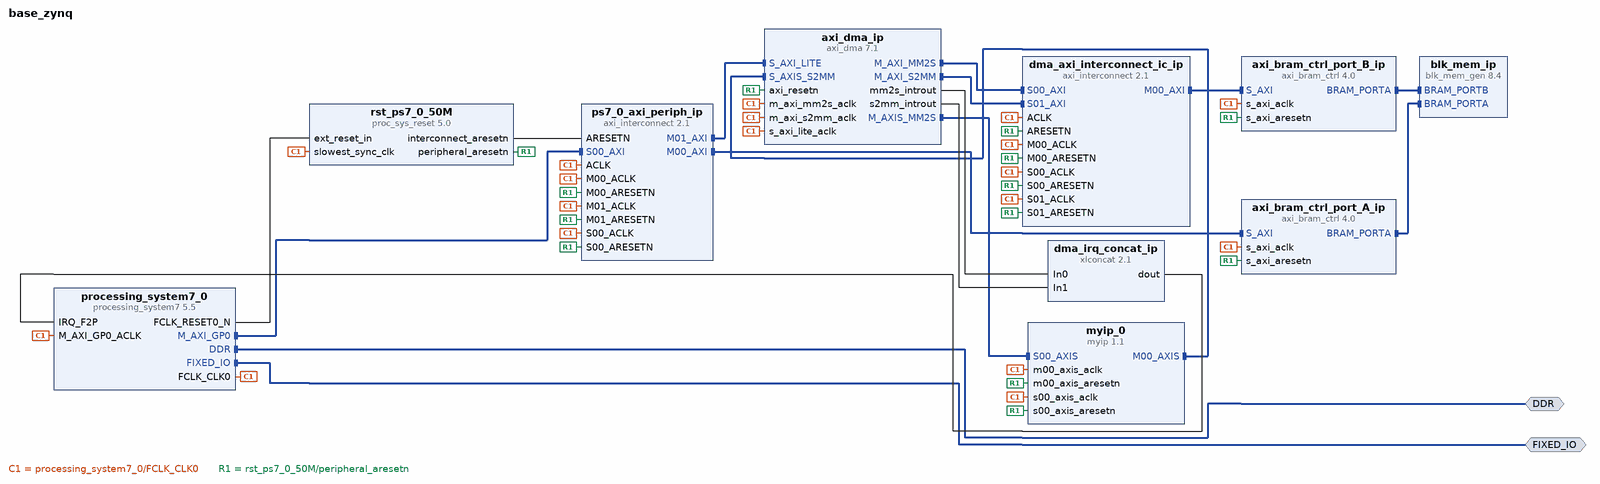
[diagram p0: block diagram of the top level]
# Vivado block design base_zynq, xc7z045ffg900-2, Vivado 2017.4
create_bd_design base_zynq

create_bd_intf_port -mode Master -vlnv xilinx.com:interface:ddrx_rtl:1.0 DDR
create_bd_intf_port -mode Master -vlnv xilinx.com:display_processing_system7:fixedio_rtl:1.0 FIXED_IO

create_bd_cell -type ip -vlnv xilinx.com:ip:xlconcat:2.1 dma_irq_concat_ip
create_bd_cell -type ip -vlnv xilinx.com:ip:axi_bram_ctrl:4.0 axi_bram_ctrl_port_A_ip
set_property -dict {CONFIG.SINGLE_PORT_BRAM 1 CONFIG.C_SELECT_XPM 0} [get_bd_cells axi_bram_ctrl_port_A_ip]
create_bd_cell -type ip -vlnv xilinx.com:ip:axi_bram_ctrl:4.0 axi_bram_ctrl_port_B_ip
set_property -dict {CONFIG.SINGLE_PORT_BRAM 1 CONFIG.C_SELECT_XPM 0} [get_bd_cells axi_bram_ctrl_port_B_ip]
create_bd_cell -type ip -vlnv xilinx.com:ip:axi_dma:7.1 axi_dma_ip
set_property -dict [list \
  CONFIG.c_include_sg 0 \
  CONFIG.c_sg_length_width 23 \
  CONFIG.c_mm2s_burst_size 256 \
  CONFIG.c_s2mm_burst_size 256 \
] [get_bd_cells axi_dma_ip]
create_bd_cell -type ip -vlnv xilinx.com:ip:axi_interconnect:2.1 dma_axi_interconnect_ic_ip
set_property -dict {CONFIG.NUM_SI 2 CONFIG.NUM_MI 1 CONFIG.SYNCHRONIZATION_STAGES 2} [get_bd_cells dma_axi_interconnect_ic_ip]
create_bd_cell -type ip -vlnv xilinx.com:ip:blk_mem_gen:8.4 blk_mem_ip
set_property -dict [list \
  CONFIG.Memory_Type True_Dual_Port_RAM \
  CONFIG.Enable_B Use_ENB_Pin \
  CONFIG.Use_RSTB_Pin true \
  CONFIG.Port_B_Clock 100 \
  CONFIG.Port_B_Write_Rate 50 \
  CONFIG.Port_B_Enable_Rate 100 \
  CONFIG.EN_SAFETY_CKT false \
] [get_bd_cells blk_mem_ip]
create_bd_cell -type ip -vlnv xilinx.com:ip:processing_system7:5.5 processing_system7_0
set_property -dict [list \
  CONFIG.PCW_UIPARAM_DDR_FREQ_MHZ 533.333313 \
  CONFIG.PCW_CPU_CPU_6X4X_MAX_RANGE 800 \
  CONFIG.PCW_APU_PERIPHERAL_FREQMHZ 667.000000 \
  CONFIG.PCW_SDIO_PERIPHERAL_FREQMHZ 50 \
  CONFIG.PCW_UART_PERIPHERAL_FREQMHZ 50 \
  CONFIG.PCW_I2C_PERIPHERAL_FREQMHZ 111.111115 \
  CONFIG.PCW_FPGA0_PERIPHERAL_FREQMHZ 50 \
  CONFIG.PCW_FPGA1_PERIPHERAL_FREQMHZ 50 \
  CONFIG.PCW_USE_FABRIC_INTERRUPT 1 \
  CONFIG.PCW_IRQ_F2P_INTR 1 \
  CONFIG.PCW_GP0_EN_MODIFIABLE_TXN 0 \
  CONFIG.PCW_GP1_EN_MODIFIABLE_TXN 0 \
  CONFIG.PCW_PERIPHERAL_BOARD_PRESET part0 \
  CONFIG.PCW_PRESET_BANK0_VOLTAGE {LVCMOS 1.8V} \
  CONFIG.PCW_PRESET_BANK1_VOLTAGE {LVCMOS 1.8V} \
  CONFIG.PCW_UIPARAM_DDR_PARTNO Custom \
  CONFIG.PCW_QSPI_PERIPHERAL_ENABLE 1 \
  CONFIG.PCW_QSPI_QSPI_IO {MIO 1 .. 6} \
  CONFIG.PCW_QSPI_GRP_SINGLE_SS_ENABLE 0 \
  CONFIG.PCW_DUAL_PARALLEL_QSPI_DATA_MODE x8 \
  CONFIG.PCW_QSPI_GRP_IO1_ENABLE 1 \
  CONFIG.PCW_QSPI_GRP_IO1_IO {MIO 0 9 .. 13} \
  CONFIG.PCW_QSPI_GRP_FBCLK_ENABLE 1 \
  CONFIG.PCW_QSPI_GRP_FBCLK_IO {MIO 8} \
  CONFIG.PCW_QSPI_INTERNAL_HIGHADDRESS 0xFDFFFFFF \
  CONFIG.PCW_ENET0_PERIPHERAL_ENABLE 1 \
  CONFIG.PCW_ENET0_ENET0_IO {MIO 16 .. 27} \
  CONFIG.PCW_ENET0_GRP_MDIO_ENABLE 1 \
  CONFIG.PCW_ENET0_GRP_MDIO_IO {MIO 52 .. 53} \
  CONFIG.PCW_ENET_RESET_ENABLE 1 \
  CONFIG.PCW_ENET_RESET_SELECT {Share reset pin} \
  CONFIG.PCW_ENET0_RESET_ENABLE 1 \
  CONFIG.PCW_ENET0_RESET_IO {MIO 47} \
  CONFIG.PCW_SD0_PERIPHERAL_ENABLE 1 \
  CONFIG.PCW_SD0_SD0_IO {MIO 40 .. 45} \
  CONFIG.PCW_SD0_GRP_CD_ENABLE 1 \
  CONFIG.PCW_SD0_GRP_CD_IO {MIO 14} \
  CONFIG.PCW_SD0_GRP_WP_ENABLE 1 \
  CONFIG.PCW_SD0_GRP_WP_IO {MIO 15} \
  CONFIG.PCW_UART1_PERIPHERAL_ENABLE 1 \
  CONFIG.PCW_UART1_UART1_IO {MIO 48 .. 49} \
  CONFIG.PCW_TTC0_PERIPHERAL_ENABLE 1 \
  CONFIG.PCW_TTC0_TTC0_IO EMIO \
  CONFIG.PCW_USB0_PERIPHERAL_ENABLE 1 \
  CONFIG.PCW_USB0_USB0_IO {MIO 28 .. 39} \
  CONFIG.PCW_USB_RESET_ENABLE 1 \
  CONFIG.PCW_USB_RESET_SELECT {Share reset pin} \
  CONFIG.PCW_USB0_RESET_ENABLE 1 \
  CONFIG.PCW_USB0_RESET_IO {MIO 7} \
  CONFIG.PCW_I2C0_PERIPHERAL_ENABLE 1 \
  CONFIG.PCW_I2C0_I2C0_IO {MIO 50 .. 51} \
  CONFIG.PCW_I2C0_GRP_INT_ENABLE 0 \
  CONFIG.PCW_I2C0_RESET_ENABLE 1 \
  CONFIG.PCW_I2C0_RESET_IO {MIO 46} \
  CONFIG.PCW_I2C_RESET_ENABLE 1 \
  CONFIG.PCW_I2C_RESET_SELECT {Share reset pin} \
  CONFIG.PCW_GPIO_MIO_GPIO_ENABLE 1 \
  CONFIG.PCW_GPIO_MIO_GPIO_IO MIO \
  CONFIG.PCW_ENET0_PERIPHERAL_FREQMHZ {100 Mbps} \
  CONFIG.preset ZC706 \
] [get_bd_cells processing_system7_0]
# 519 more settings of processing_system7_0 are not shown: defaults, MIO pin electricals, DDR timing, and values the tool derives
create_bd_cell -type ip -vlnv xilinx.com:ip:axi_interconnect:2.1 ps7_0_axi_periph_ip
set_property -dict {CONFIG.NUM_MI 2 CONFIG.SYNCHRONIZATION_STAGES 2} [get_bd_cells ps7_0_axi_periph_ip]
create_bd_cell -type ip -vlnv xilinx.com:ip:proc_sys_reset:5.0 rst_ps7_0_50M
create_bd_cell -type ip -vlnv xilinx.com:user:myip:1.1 myip_0

# ---- connections ----

connect_bd_intf_net -intf_net axi_bram_ctrl_0_BRAM_PORTA [get_bd_intf_pins axi_bram_ctrl_port_A_ip/BRAM_PORTA] [get_bd_intf_pins blk_mem_ip/BRAM_PORTA]
connect_bd_intf_net [get_bd_intf_pins processing_system7_0/M_AXI_GP0] [get_bd_intf_pins ps7_0_axi_periph_ip/S00_AXI]
connect_bd_intf_net [get_bd_intf_pins ps7_0_axi_periph_ip/M00_AXI] [get_bd_intf_pins axi_bram_ctrl_port_A_ip/S_AXI]
connect_bd_intf_net [get_bd_intf_pins axi_bram_ctrl_port_B_ip/BRAM_PORTA] [get_bd_intf_pins blk_mem_ip/BRAM_PORTB]
connect_bd_intf_net [get_bd_intf_pins axi_dma_ip/S_AXI_LITE] [get_bd_intf_pins ps7_0_axi_periph_ip/M01_AXI]
connect_bd_intf_net [get_bd_intf_pins axi_dma_ip/M_AXI_MM2S] [get_bd_intf_pins dma_axi_interconnect_ic_ip/S00_AXI]
connect_bd_intf_net [get_bd_intf_pins axi_dma_ip/M_AXI_S2MM] [get_bd_intf_pins dma_axi_interconnect_ic_ip/S01_AXI]
connect_bd_intf_net [get_bd_intf_pins dma_axi_interconnect_ic_ip/M00_AXI] [get_bd_intf_pins axi_bram_ctrl_port_B_ip/S_AXI]
connect_bd_intf_net [get_bd_intf_pins myip_0/M00_AXIS] [get_bd_intf_pins axi_dma_ip/S_AXIS_S2MM]
connect_bd_intf_net [get_bd_intf_pins axi_dma_ip/M_AXIS_MM2S] [get_bd_intf_pins myip_0/S00_AXIS]
connect_bd_intf_net [get_bd_intf_ports DDR] [get_bd_intf_pins processing_system7_0/DDR]
connect_bd_intf_net [get_bd_intf_ports FIXED_IO] [get_bd_intf_pins processing_system7_0/FIXED_IO]
connect_bd_net [get_bd_pins processing_system7_0/FCLK_CLK0] \
  [get_bd_pins axi_bram_ctrl_port_A_ip/s_axi_aclk] [get_bd_pins axi_bram_ctrl_port_B_ip/s_axi_aclk] \
  [get_bd_pins axi_dma_ip/s_axi_lite_aclk] [get_bd_pins axi_dma_ip/m_axi_mm2s_aclk] [get_bd_pins axi_dma_ip/m_axi_s2mm_aclk] \
  [get_bd_pins processing_system7_0/M_AXI_GP0_ACLK] [get_bd_pins rst_ps7_0_50M/slowest_sync_clk] \
  [get_bd_pins dma_axi_interconnect_ic_ip/ACLK] [get_bd_pins dma_axi_interconnect_ic_ip/S00_ACLK] \
  [get_bd_pins dma_axi_interconnect_ic_ip/M00_ACLK] [get_bd_pins dma_axi_interconnect_ic_ip/S01_ACLK] \
  [get_bd_pins ps7_0_axi_periph_ip/ACLK] [get_bd_pins ps7_0_axi_periph_ip/S00_ACLK] \
  [get_bd_pins ps7_0_axi_periph_ip/M00_ACLK] [get_bd_pins ps7_0_axi_periph_ip/M01_ACLK] [get_bd_pins myip_0/s00_axis_aclk] \
  [get_bd_pins myip_0/m00_axis_aclk]
connect_bd_net [get_bd_pins processing_system7_0/FCLK_RESET0_N] [get_bd_pins rst_ps7_0_50M/ext_reset_in]
connect_bd_net [get_bd_pins rst_ps7_0_50M/peripheral_aresetn] \
  [get_bd_pins axi_bram_ctrl_port_A_ip/s_axi_aresetn] [get_bd_pins axi_bram_ctrl_port_B_ip/s_axi_aresetn] \
  [get_bd_pins axi_dma_ip/axi_resetn] [get_bd_pins dma_axi_interconnect_ic_ip/ARESETN] \
  [get_bd_pins dma_axi_interconnect_ic_ip/S00_ARESETN] [get_bd_pins dma_axi_interconnect_ic_ip/M00_ARESETN] \
  [get_bd_pins dma_axi_interconnect_ic_ip/S01_ARESETN] [get_bd_pins ps7_0_axi_periph_ip/S00_ARESETN] \
  [get_bd_pins ps7_0_axi_periph_ip/M00_ARESETN] [get_bd_pins ps7_0_axi_periph_ip/M01_ARESETN] \
  [get_bd_pins myip_0/m00_axis_aresetn] [get_bd_pins myip_0/s00_axis_aresetn]
connect_bd_net [get_bd_pins rst_ps7_0_50M/interconnect_aresetn] [get_bd_pins ps7_0_axi_periph_ip/ARESETN]
connect_bd_net [get_bd_pins axi_dma_ip/mm2s_introut] [get_bd_pins dma_irq_concat_ip/In0]
connect_bd_net [get_bd_pins axi_dma_ip/s2mm_introut] [get_bd_pins dma_irq_concat_ip/In1]
connect_bd_net -net xlconcat_0_dout [get_bd_pins dma_irq_concat_ip/dout] [get_bd_pins processing_system7_0/IRQ_F2P]

# ---- address map ----
assign_bd_address -offset 0x40000000 -range 64K -target_address_space [get_bd_addr_spaces axi_dma_ip/Data_MM2S] [get_bd_addr_segs axi_bram_ctrl_port_B_ip/S_AXI/Mem0]
assign_bd_address -offset 0x40000000 -range 64K -target_address_space [get_bd_addr_spaces axi_dma_ip/Data_S2MM] [get_bd_addr_segs axi_bram_ctrl_port_B_ip/S_AXI/Mem0]
assign_bd_address -offset 0x40000000 -range 64K -target_address_space [get_bd_addr_spaces processing_system7_0/Data] [get_bd_addr_segs axi_bram_ctrl_port_A_ip/S_AXI/Mem0]
assign_bd_address -offset 0x40400000 -range 64K -target_address_space [get_bd_addr_spaces processing_system7_0/Data] [get_bd_addr_segs axi_dma_ip/S_AXI_LITE/Reg]

validate_bd_design
save_bd_design
